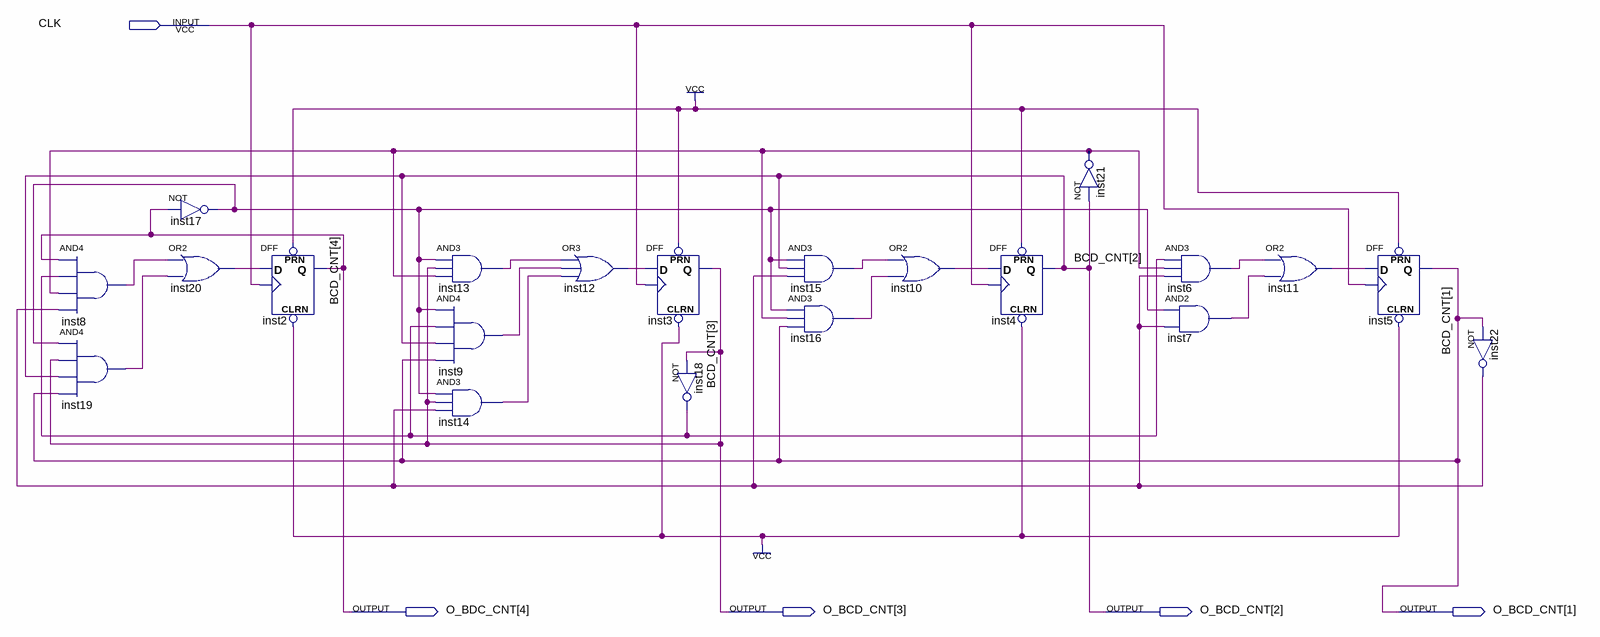
[diagram p0: schematic sheet]
// Quartus schematic BCD_CNT.bdf as structural Verilog: 21 symbols, 5 pins
module BCD_CNT (
  input  CLK,
  output [4:4] O_BDC_CNT,
  output [3:1] O_BCD_CNT
);

  wire inst6_out, inst7_out, inst8_out, inst9_out, inst10_out, inst11_out, inst12_out, inst13_out,
       inst14_out, inst15_out, inst16_out, inst17_out, inst18_out, inst19_out, inst20_out, inst21_out,
       inst22_out;

  and inst8 (inst8_out, O_BDC_CNT[4], inst18_out, inst21_out, inst22_out);
  and inst19 (inst19_out, inst17_out, O_BCD_CNT[3], O_BCD_CNT[2], O_BCD_CNT[1]);
  not inst17 (inst17_out, O_BDC_CNT[4]);
  or inst20 (inst20_out, inst8_out, inst19_out);
  DFF inst2 (.CLRN(1'b1), .CLK(CLK), .D(inst20_out), .PRN(1'b1), .Q(O_BDC_CNT[4]));
  and inst13 (inst13_out, inst17_out, O_BCD_CNT[3], inst21_out);
  and inst9 (inst9_out, inst17_out, inst18_out, O_BCD_CNT[2], O_BCD_CNT[1]);
  and inst14 (inst14_out, inst17_out, O_BCD_CNT[3], inst22_out);
  or inst12 (inst12_out, inst13_out, inst9_out, inst14_out);
  DFF inst3 (.CLRN(1'b1), .CLK(CLK), .D(inst12_out), .PRN(1'b1), .Q(O_BCD_CNT[3]));
  not inst18 (inst18_out, O_BCD_CNT[3]);
  and inst15 (inst15_out, inst17_out, O_BCD_CNT[2], inst22_out);
  and inst16 (inst16_out, inst17_out, inst21_out, O_BCD_CNT[1]);
  or inst10 (inst10_out, inst15_out, inst16_out);
  DFF inst4 (.CLRN(1'b1), .CLK(CLK), .D(inst10_out), .PRN(1'b1), .Q(O_BCD_CNT[2]));
  not inst21 (inst21_out, O_BCD_CNT[2]);
  and inst6 (inst6_out, inst18_out, inst21_out, inst22_out);
  and inst7 (inst7_out, inst17_out, inst22_out);
  or inst11 (inst11_out, inst6_out, inst7_out);
  DFF inst5 (.CLRN(1'b1), .CLK(CLK), .D(inst11_out), .PRN(1'b1), .Q(O_BCD_CNT[1]));
  not inst22 (inst22_out, O_BCD_CNT[1]);

  // Other names for the same wires on the sheet: BCD_CNT[4:1] = {O_BDC_CNT[4], O_BCD_CNT}
endmodule
